# Altium schematic sheet QEP.SchDoc
size A3
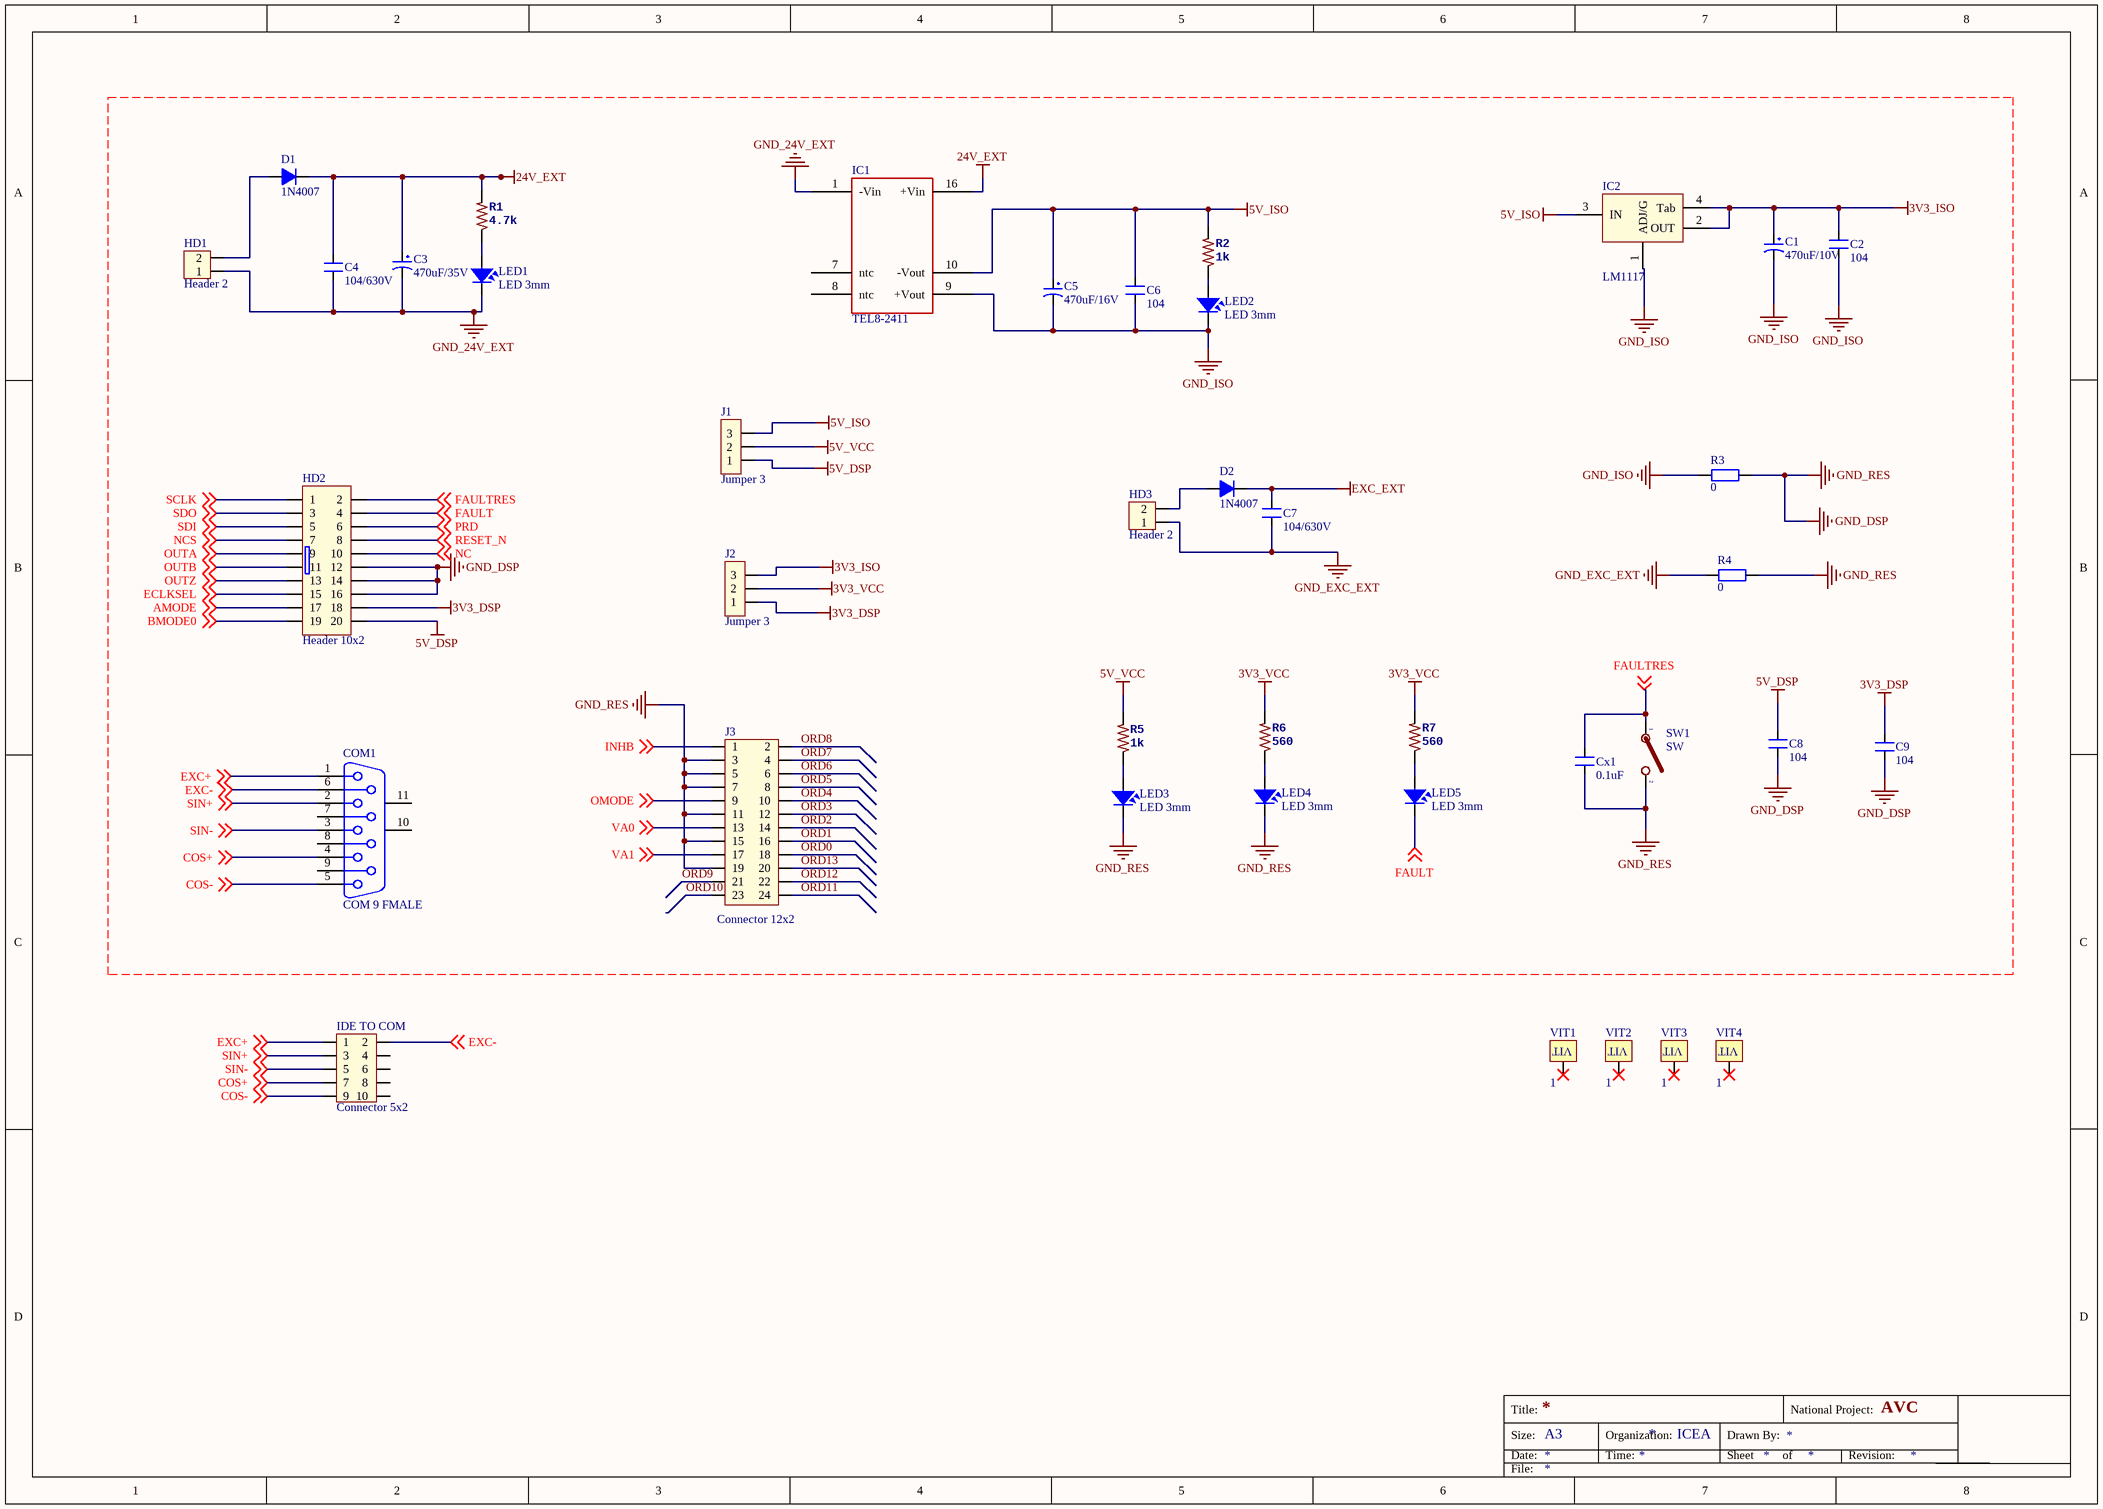
[diagram p0: QEP.SchDoc]

## Parts
C1  470uF/10V  [CP 470uF/35V SMD 10x10mm]
C2  104  [CN1.5]
C3  470uF/35V  [CP 470uF/35V SMD 10x10mm]
C4  104/630V  [CN3]
C5  470uF/16V  [CP 470uF/35V SMD 10x10mm]
C6  104  [CN1.5]
C7  104/630V  [CN3]
C8  104  [CN1.5]
C9  104  [CN1.5]
COM1  COM 9 FMALE  [DSB 9-F]
Cx1  0.1uF  [CN-SMD-0805]
D1  1N4007  [DIO-SMD-106]
D2  1N4007  [DIO-SMD-106]
HD1  Header 2  [HED2T]
HD2  Header 10x2  [IDE 20]
HD3  Header 2  [HED2T]
IC1  TEL8-2411  [TEL8-2411]
IC2  LM1117  [SOT223-4N]
IDE_TO_COM  Connector 5x2  [IDE 10 duc]
J1  Jumper 3  [JP3-CLOSED]
J2  Jumper 3  [JP3-CLOSED]
J3  Connector 12x2  [JP12X2]
LED1  LED 3mm  [LED-0805-Red]
LED2  LED 3mm  [LED-0805-Red]
LED3  LED 3mm  [LED-0805-Red]
LED4  LED 3mm  [LED-0805-Red]
LED5  LED 3mm  [LED-0805-Red]
R1  4.7k  [SM-0805]
R2  1k  [RES-SMD-0805]
R3  0  [RES-SMD-0805]
R4  0  [RES-SMD-0805]
R5  1k  [RES-SMD-0805]
R6  560  [RES-SMD-0805]
R7  560  [RES-SMD-0805]
SW1  SW  [SW-SMD]
VIT1  1  [VIT]
VIT2  1  [VIT]
VIT3  1  [VIT]
VIT4  1  [VIT]

## Nets
3V3_DSP: C9.2 HD2.18 J2.1
3V3_ISO: C1.1 C2.2 IC2.2(OUT) IC2.4(Tab) J2.3
3V3_VCC: J2.2 R6.2 R7.2
5V_DSP: C8.2 HD2.20 J1.1
5V_ISO: C5.1 C6.2 IC1.10(-Vout) IC2.3(IN) J1.3 R2.2
5V_VCC: J1.2 R5.2
24V_EXT: C3.1 C4.2 D1.2(K) IC1.16(+Vin) R1.2
EXC_EXT: C7.2 D2.2(K)
GND_24V_EXT: C3.2 C4.1 HD1.1 IC1.1(-Vin) LED1.2
GND_DSP: C8.1 C9.1 Cx1.1 HD2.12 HD2.14 HD2.16 J3.3 J3.5 J3.7 J3.11 J3.15 J3.19 LED3.2 LED4.2 R3.2 R4.2 SW1.2  [also labelled GND_RES]
GND_EXC_EXT: C7.1 HD3.1 R4.1
GND_ISO: C1.2 C2.1 C5.2 C6.1 IC1.9(+Vout) IC2.1(ADJ/G) LED2.2 R3.1
AMODE: HD2.17 ; off-sheet AMODE
BMODE0: HD2.19 ; off-sheet BMODE0
COS+: COM1.4 IDE_TO_COM.7 ; off-sheet COS+
COS-: COM1.5 IDE_TO_COM.9 ; off-sheet COS-
ECLKSEL: HD2.15 ; off-sheet ECLKSEL
EXC+: COM1.1 IDE_TO_COM.1 ; off-sheet EXC+
EXC-: COM1.6 IDE_TO_COM.2 ; off-sheet EXC-
FAULT: HD2.4 LED5.2 ; off-sheet FAULT
FAULTRES: Cx1.2 HD2.2 SW1.1 ; off-sheet FAULTRES
INHB: J3.1 ; off-sheet INHB
NC: HD2.10 ; off-sheet NC
NCS: HD2.7 ; off-sheet NCS
OMODE: J3.9 ; off-sheet OMODE
ORD0: J3.18
ORD1: J3.16
ORD2: J3.14
ORD3: J3.12
ORD4: J3.10
ORD5: J3.8
ORD6: J3.6
ORD7: J3.4
ORD8: J3.2
ORD9: J3.21
ORD10: J3.23
ORD11: J3.24
ORD12: J3.22
ORD13: J3.20
OUTA: HD2.9 ; off-sheet OUTA
OUTB: HD2.11 ; off-sheet OUTB
OUTZ: HD2.13 ; off-sheet OUTZ
PRD: HD2.6 ; off-sheet PRD
RESET_N: HD2.8 ; off-sheet RESET_N
SCLK: HD2.1 ; off-sheet SCLK
SDI: HD2.5 ; off-sheet SDI
SDO: HD2.3 ; off-sheet SDO
SIN+: COM1.2 IDE_TO_COM.3 ; off-sheet SIN+
SIN-: COM1.3 IDE_TO_COM.5 ; off-sheet SIN-
VA0: J3.13 ; off-sheet VA0
VA1: J3.17 ; off-sheet VA1
NetD1_1: D1.1(A) HD1.2
NetD2_1: D2.1(A) HD3.2
NetLED1_1: LED1.1 R1.1
NetLED2_1: LED2.1 R2.1
NetLED3_1: LED3.1 R5.1
NetLED4_1: LED4.1 R6.1
NetLED5_1: LED5.1 R7.1

Not connected (* = marked no-connect by the designer): COM1 7 8 9 10(MH1) 11(MH2); IC1 7(ntc) 8(ntc); IDE_TO_COM 4 6 8 10; VIT1 1(VIT)*; VIT2 1(VIT)*; VIT3 1(VIT)*; VIT4 1(VIT)*

## Notes on the sheet
- Title:
- Size:
- Date:
- A3
- Organization:
- Time:
- ICEA
- Sheet
- Drawn By:
- of
- National Project:
- Revision:
- AVC
- File:

## Library data of the parts
C1 C3 C5 = CP3: Cap 100uF/35V - 470uF/16V; Value: 100uF/35V/50V; Description 1: 1000uF/6,3V - 470uF/16V - 330uF - 25V; Description 2: 220uF/35V - 100uF/50V - 63V - 4,7uF/200V; Description 3: 22uF => 33uF100V - 3,3uF => 4,7uF/250V; Description 4: 2,2uF =>3,3uF/350 - 2,2uF/400V - 1uF/450V
C2 C6 C8 C9 = CN1.5: Cap np 682pF => 104pF; Value: 0.01uF
C4 C7 = CN3: Cap np W0.3; Value: 0,047uF; Copyright: VanDungEvn
COM1 = DSB9F: COM 9; PackageDocument: O; Positions: 9; Gender: Receptacle; Value: COM 9; Published: 15-Jun-2001; LatestRevisionDate: 17-Jul-2002; LatestRevisionNote: Re-released for DXP Platform.; DatasheetDocument: 1-Sep-1999; PackageReference: 788750; Publisher: Altium Limited; Orientation: Right Angle
Cx1 = CN: Value: 33pF
D1 D2 = D2A: Diode 2A; Value: 1N4007
HD1 HD3 = Hed2: Header 2 (Green); Value: Header 2
HD2 = HED10X2: Value: Header 5x2
IC2 = LM1117: 3v3; Value: LM317
IDE_TO_COM = JP5x2: Value: Connector 4x2
J1 J2 = JP3: Value: J3
J3 = JP12x2: Value: Connector 4x2
LED1-LED5 = LED 3mm: LED Single colour Green and Red; Value: LED 3 ly Single Colour
R1 R2 R5-R7 = R-US_R0805: RESISTOR, American symbol
R3 R4 = R1/4W: Resistor 1/4W; Value: R1/4W - 1K
SW1 = SW: Switch button 2 pin; Value: SW chip 2 pin
VIT1-VIT4 = VIT: Oc Vit